# EAGLE schematic Micromouse (EAGLE 6.3)
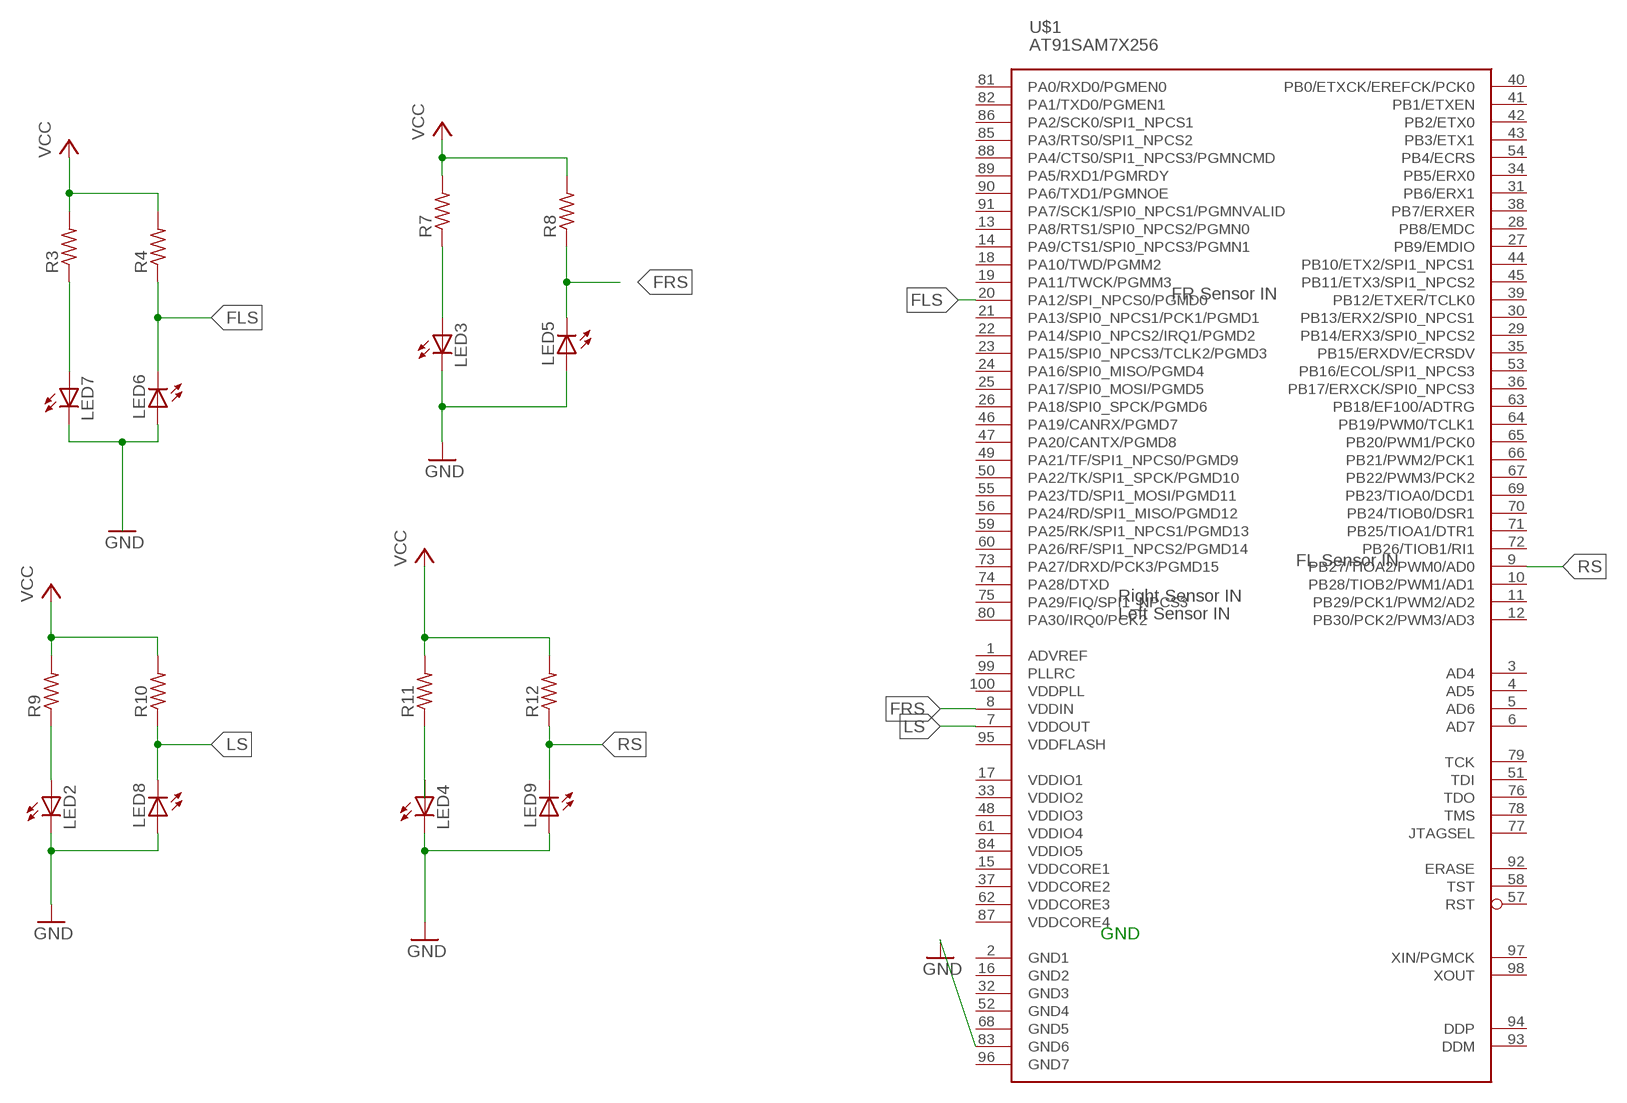
[diagram p0: schematic, sheet 1]

## Parts
LED2  LED5MM  [LED5MM]
LED3  LED5MM  [LED5MM]
LED4  LED5MM  [LED5MM]
LED5  LED5MM  [LED5MM]
LED6  LED5MM  [LED5MM]
LED7  LED5MM  [LED5MM]
LED8  LED5MM  [LED5MM]
LED9  LED5MM  [LED5MM]
R3  R-US_R0805  [R0805]
R4  R-US_R0805  [R0805]
R7  R-US_R0805  [R0805]
R8  R-US_R0805  [R0805]
R9  R-US_R0805  [R0805]
R10  R-US_R0805  [R0805]
R11  R-US_R0805  [R0805]
R12  R-US_R0805  [R0805]
U$1  AT91SAM7X256  [LQFP100]

## Nets
FLS: LED6.K(C) R4.1 U$1.20(PA12/SPI_NPCS0/PGMD0)
FRS: LED5.K(C) R8.1 U$1.8(VDDIN)
GND: LED2.K(C) LED3.K(C) LED4.K(C) LED5.A LED8.A LED9.A U$1.83(GND6)
LS: LED8.K(C) R10.1 U$1.7(VDDOUT)
N$1: LED7.A R3.1
N$4: LED6.A LED7.K(C)
N$7: LED3.A R7.1
N$10: LED2.A R9.1
N$11: R11.1
RS: LED9.K(C) R12.1 U$1.9(PB27/TIOA2/PWM0/AD0)
VCC: R3.2 R4.2 R7.2 R8.2 R9.2 R10.2 R11.2 R12.2
Unconnected: LED4.A U$1.1(ADVREF) U$1.2(GND1) U$1.3(AD4) U$1.4(AD5) U$1.5(AD6) U$1.6(AD7) U$1.10(PB28/TIOB2/PWM1/AD1) U$1.11(PB29/PCK1/PWM2/AD2) U$1.12(PB30/PCK2/PWM3/AD3) U$1.13(PA8/RTS1/SPI0_NPCS2/PGMN0) U$1.14(PA9/CTS1/SPI0_NPCS3/PGMN1) U$1.15(VDDCORE1) U$1.16(GND2) U$1.17(VDDIO1) U$1.18(PA10/TWD/PGMM2) U$1.19(PA11/TWCK/PGMM3) U$1.21(PA13/SPI0_NPCS1/PCK1/PGMD1) U$1.22(PA14/SPI0_NPCS2/IRQ1/PGMD2) U$1.23(PA15/SPI0_NPCS3/TCLK2/PGMD3) U$1.24(PA16/SPI0_MISO/PGMD4) U$1.25(PA17/SPI0_MOSI/PGMD5) U$1.26(PA18/SPI0_SPCK/PGMD6) U$1.27(PB9/EMDIO) U$1.28(PB8/EMDC) U$1.29(PB14/ERX3/SPI0_NPCS2) U$1.30(PB13/ERX2/SPI0_NPCS1) U$1.31(PB6/ERX1) U$1.32(GND3) U$1.33(VDDIO2) U$1.34(PB5/ERX0) U$1.35(PB15/ERXDV/ECRSDV) U$1.36(PB17/ERXCK/SPI0_NPCS3) U$1.37(VDDCORE2) U$1.38(PB7/ERXER) U$1.39(PB12/ETXER/TCLK0) U$1.40(PB0/ETXCK/EREFCK/PCK0) U$1.41(PB1/ETXEN) U$1.42(PB2/ETX0) U$1.43(PB3/ETX1) U$1.44(PB10/ETX2/SPI1_NPCS1) U$1.45(PB11/ETX3/SPI1_NPCS2) U$1.46(PA19/CANRX/PGMD7) U$1.47(PA20/CANTX/PGMD8) U$1.48(VDDIO3) U$1.49(PA21/TF/SPI1_NPCS0/PGMD9) U$1.50(PA22/TK/SPI1_SPCK/PGMD10) U$1.51(TDI) U$1.52(GND4) U$1.53(PB16/ECOL/SPI1_NPCS3) U$1.54(PB4/ECRS) U$1.55(PA23/TD/SPI1_MOSI/PGMD11) U$1.56(PA24/RD/SPI1_MISO/PGMD12) U$1.57(RST) U$1.58(TST) U$1.59(PA25/RK/SPI1_NPCS1/PGMD13) U$1.60(PA26/RF/SPI1_NPCS2/PGMD14) U$1.61(VDDIO4) U$1.62(VDDCORE3) U$1.63(PB18/EF100/ADTRG) U$1.64(PB19/PWM0/TCLK1) U$1.65(PB20/PWM1/PCK0) U$1.66(PB21/PWM2/PCK1) U$1.67(PB22/PWM3/PCK2) U$1.68(GND5) U$1.69(PB23/TIOA0/DCD1) U$1.70(PB24/TIOB0/DSR1) U$1.71(PB25/TIOA1/DTR1) U$1.72(PB26/TIOB1/RI1) U$1.73(PA27/DRXD/PCK3/PGMD15) U$1.74(PA28/DTXD) U$1.75(PA29/FIQ/SPI1_NPCS3) U$1.76(TDO) U$1.77(JTAGSEL) U$1.78(TMS) U$1.79(TCK) U$1.80(PA30/IRQ0/PCK2) U$1.81(PA0/RXD0/PGMEN0) U$1.82(PA1/TXD0/PGMEN1) U$1.84(VDDIO5) U$1.85(PA3/RTS0/SPI1_NPCS2) U$1.86(PA2/SCK0/SPI1_NPCS1) U$1.87(VDDCORE4) U$1.88(PA4/CTS0/SPI1_NPCS3/PGMNCMD) U$1.89(PA5/RXD1/PGMRDY) U$1.90(PA6/TXD1/PGMNOE) U$1.91(PA7/SCK1/SPI0_NPCS1/PGMNVALID) U$1.92(ERASE) U$1.93(DDM) U$1.94(DDP) U$1.95(VDDFLASH) U$1.96(GND7) U$1.97(XIN/PGMCK) U$1.98(XOUT) U$1.99(PLLRC) U$1.100(VDDPLL)

## Notes on the sheet
- FR Sensor IN
- FL Sensor IN
- Right Sensor IN
- Left Sensor IN
- GND

## Library data of the parts
LED2-LED9 = adafruit:LED: LED OSRAM: - CHIPLED LG R971, LG N971, LY N971, LG Q971, LY Q971, LO R971, LY R971 LH N974, LH R974 LS Q976, LO Q976, LY Q976 LO Q996 - Hyper CHIPLED LW Q18S LB Q993, LB Q99A, LB R99A - SideLED LS A670, LO A670, LY A670, LG A670, LP A670 LB A673, LV A673, LT A673, LW A673 LH A674 LY A675 LS A676, LA A676, LO A676, LY A676, LW A676 LS A679, LY A679, LG A679 - Hyper Micro SIDELED® LS Y876, LA Y876, LO Y876, LY Y876 LT Y87S - SmartLED LW L88C, LW L88S LB L89C, LB L89S, LG L890 LS L89K, LO L89K, LY L89K LS L896, LA L896, LO L896, LY L896 - TOPLED LS T670, LO T670, LY T670, LG T670, LP T670 LSG T670, LSP T670, LSY T670, LOP T670, LYG T670 LG T671, LOG T671, LSG T671 LB T673, LV T673, LT T673, LW T673 LH T674 LS T676, LA T676, LO T676, LY T676, LB T676, LH T676, LSB T676, LW T676 LB T67C, LV T67C, LT T67C, LS T67K, LO T67K, LY T67K, LW E67C LS E67B, LA E67B, LO E67B, LY E67B, LB E67C, LV E67C, LT E67C LW T67C LS T679, LY T679, LG T679 LS T770, LO T770, LY T770, LG T770, LP T770 LB T773, LV T773, LT T773, LW T773 LH T774 LS E675, LA E675, LY E675, LS T675 LS T776, LA T776, LO T776, LY T776, LB T776 LHGB T686 LT T68C, LB T68C - Hyper Mini TOPLED® LB M676 - Mini TOPLED Santana® LG M470 LS M47K, LO M47K, LY M47K Source: http://www.osram.convergy.de/
R3 R4 R7-R12 = adafruit:R-US_: RESISTOR, American symbol
U$1 = at91sam7x-xxxx:AT91SAM7X256: Atmels AT91SAM7X 128/256/512 32-bit ARM in LQFP100 package based on olimex development board http://www.olimex.com/dev/images/ARM/ATMEL/SAM7-EX256-REV-Bsch.gif by Grzegorz Rajtar e-mail: mcgregor@blackmesaeast.com.pl